# EAGLE schematic SimplePayload (EAGLE 9.2.2)
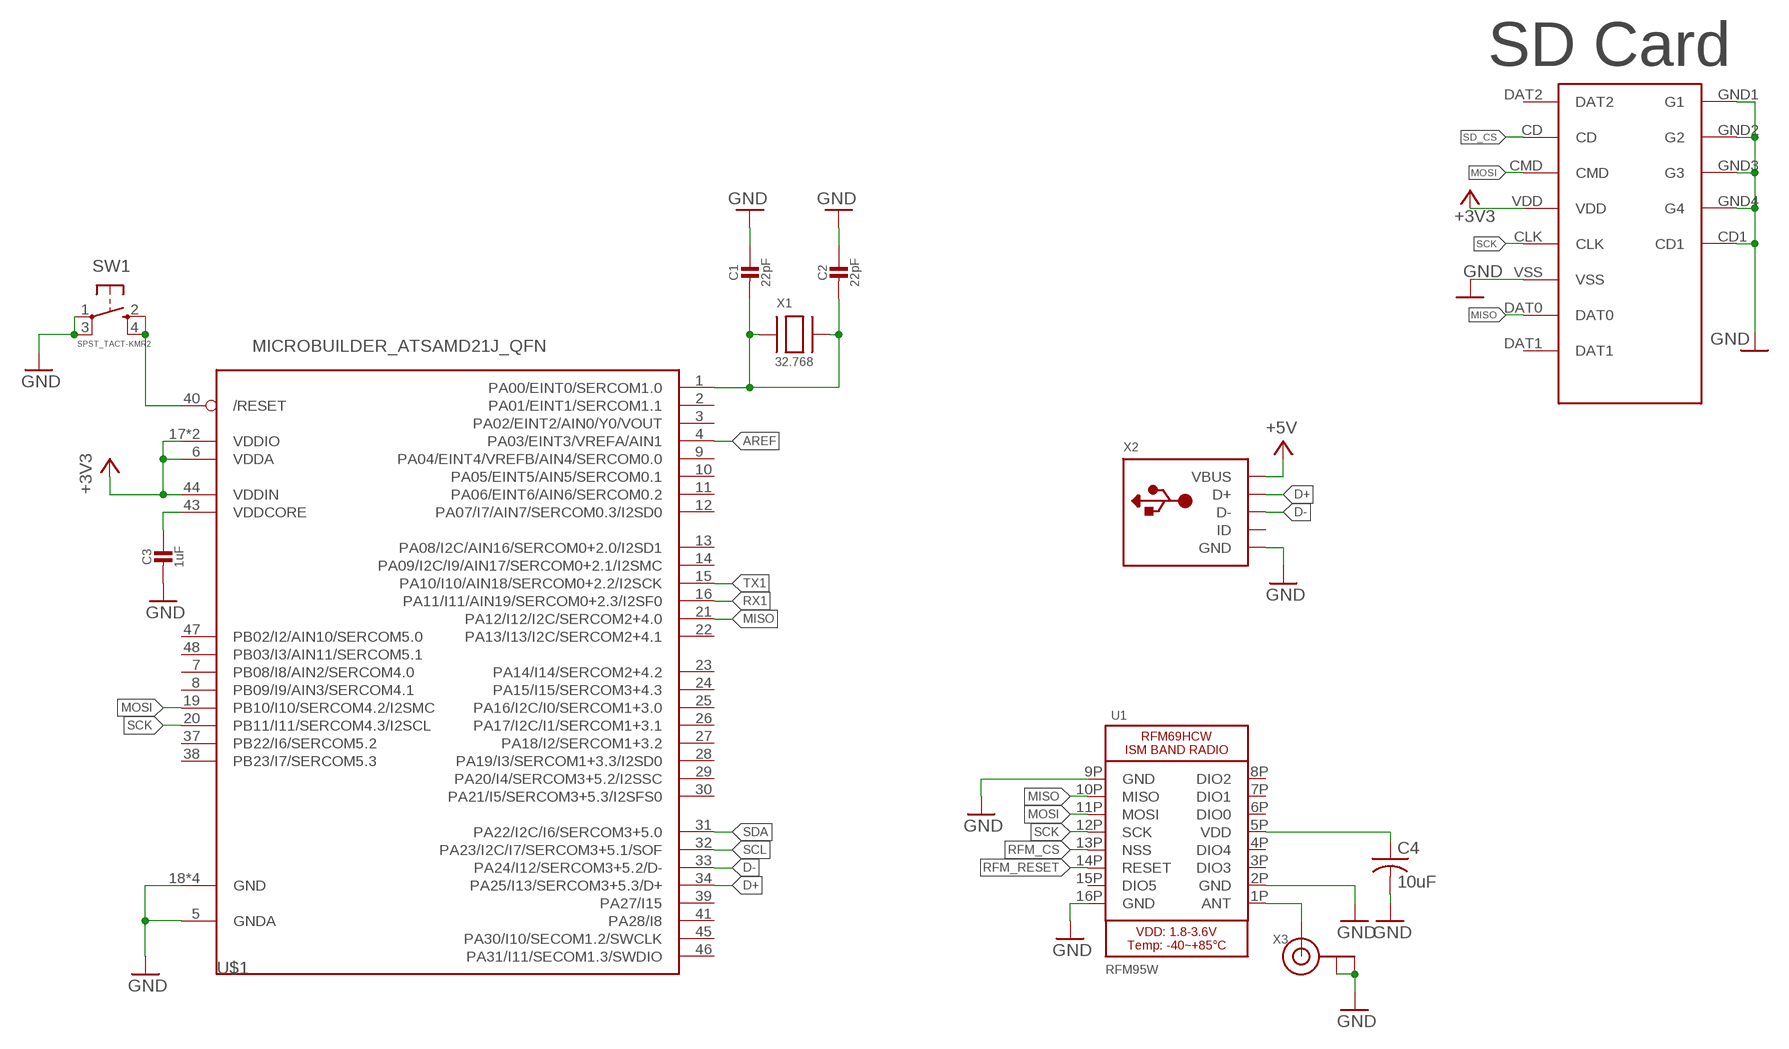
[diagram p0: schematic, sheet 1]

## Parts
C1  22pF  MICROBUILDER_CAP_CERAMIC0603_NO  [MICROBUILDER_0603-NO]
C2  22pF  MICROBUILDER_CAP_CERAMIC0603_NO  [MICROBUILDER_0603-NO]
C3  1uF  MICROBUILDER_CAP_CERAMIC0603_NO  [MICROBUILDER_0603-NO]
C4  10uF  C-USC0805  [C0805]
SW1  SPST_TACT-KMR2  [KMR2]
U1  RFM95W  MICROBUILDER_RFM69HCW_SMT  [MICROBUILDER_RFMHCW_SMT]
U$1  MICROBUILDER_ATSAMD21J_QFN  [MICROBUILDER_TQFN48_7MM]
U$4  MICRO_SD  [MICRO_SD_HINGED]
X1  32.768  ADAFRUIT2_XTAL-3.2X1.5  [ADAFRUIT2_XTAL3215]
X2  MICROBUILDER_USB_MICRO_20329_V2  [MICROBUILDER_4UCONN_20329_V2]
X3  MICROBUILDER_ANTENNA_U.FL  [MICROBUILDER_U.FL]

## Nets
+3V3: U$1.6(VDDA) U$1.17(VDDIO) U$1.36(VDDIO) U$1.44(VDDIN) U$4.VDD
+5V: X2.VBUS
AREF: U$1.4(PA03/EINT3/VREFA/AIN1)
D+: U$1.34(PA25/I13/SERCOM3+5.3/D+) X2.D+
D-: U$1.33(PA24/I12/SERCOM3+5.2/D-) X2.D-
GND: C1.1 C2.1 C3.2 C4.2 SW1.1(P) SW1.3(P1) U1.2P(GND) U1.9P(GND) U1.16P(GND) U$1.5(GNDA) U$1.18(GND) U$1.35(GND) U$1.42(GND) U$1.THERMAL(GND) U$4.CD1 U$4.GND1(G1) U$4.GND2(G2) U$4.GND3(G3) U$4.GND4(G4) U$4.VSS X2.BASE@1(GND) X2.BASE@2(GND) X2.GND X2.SPRT@1(GND) X2.SPRT@2(GND) X2.SPRT@3(GND) X2.SPRT@4(GND) X3.1(GND) X3.2(GND)
MISO: U1.10P(MISO) U$1.21(PA12/I12/I2C/SERCOM2+4.0) U$4.DAT0
MOSI: U1.11P(MOSI) U$1.19(PB10/I10/SERCOM4.2/I2SMC) U$4.CMD
N$1: C1.2 C2.2 U$1.1(PA00/EINT0/SERCOM1.0) X1.P$1 X1.P$2
N$2: SW1.2(S) SW1.4(S1) U$1.40(/RESET)
N$3: C3.1 U$1.43(VDDCORE)
N$4: U1.1P(ANT) X3.3(SIGNAL)
N$5: C4.1 U1.5P(VDD)
RFM_CS: U1.13P(NSS)
RFM_RESET: U1.14P(RESET)
RX1: U$1.16(PA11/I11/AIN19/SERCOM0+2.3/I2SF0)
SCK: U1.12P(SCK) U$1.20(PB11/I11/SERCOM4.3/I2SCL) U$4.CLK
SCL: U$1.32(PA23/I2C/I7/SERCOM3+5.1/SOF)
SD_CS: U$4.CD
SDA: U$1.31(PA22/I2C/I6/SERCOM3+5.0)
TX1: U$1.15(PA10/I10/AIN18/SERCOM0+2.2/I2SCK)
Unconnected: U1.3P(DIO3) U1.4P(DIO4) U1.6P(DIO0) U1.7P(DIO1) U1.8P(DIO2) U1.15P(DIO5) U$1.2(PA01/EINT1/SERCOM1.1) U$1.3(PA02/EINT2/AIN0/Y0/VOUT) U$1.7(PB08/I8/AIN2/SERCOM4.0) U$1.8(PB09/I9/AIN3/SERCOM4.1) U$1.9(PA04/EINT4/VREFB/AIN4/SERCOM0.0) U$1.10(PA05/EINT5/AIN5/SERCOM0.1) U$1.11(PA06/EINT6/AIN6/SERCOM0.2) U$1.12(PA07/I7/AIN7/SERCOM0.3/I2SD0) U$1.13(PA08/I2C/AIN16/SERCOM0+2.0/I2SD1) U$1.14(PA09/I2C/I9/AIN17/SERCOM0+2.1/I2SMC) U$1.22(PA13/I13/I2C/SERCOM2+4.1) U$1.23(PA14/I14/SERCOM2+4.2) U$1.24(PA15/I15/SERCOM3+4.3) U$1.25(PA16/I2C/I0/SERCOM1+3.0) U$1.26(PA17/I2C/I1/SERCOM1+3.1) U$1.27(PA18/I2/SERCOM1+3.2) U$1.28(PA19/I3/SERCOM1+3.3/I2SD0) U$1.29(PA20/I4/SERCOM3+5.2/I2SSC) U$1.30(PA21/I5/SERCOM3+5.3/I2SFS0) U$1.37(PB22/I6/SERCOM5.2) U$1.38(PB23/I7/SERCOM5.3) U$1.39(PA27/I15) U$1.41(PA28/I8) U$1.45(PA30/I10/SECOM1.2/SWCLK) U$1.46(PA31/I11/SECOM1.3/SWDIO) U$1.47(PB02/I2/AIN10/SERCOM5.0) U$1.48(PB03/I3/AIN11/SERCOM5.1) U$4.DAT1 U$4.DAT2 X2.ID

## Notes on the sheet
- SD Card

## Library data of the parts
C1-C3 = Adafruit Feather M0 RFMxx:MICROBUILDER_CAP_CERAMIC: Ceramic Capacitors For new designs, use the packages preceded by an '_' character since they are more reliable: The following footprints should be used on most boards: _0402 - Standard footprint for regular board layouts _0603 - Standard footprint for regular board layouts _0805 - Standard footprint for regular board layouts _1206 - Standard footprint for regular board layouts For extremely tight-pitch boards where space is at a premium, the following 'micro-pitch' footprints can be used (smaller pads, no silkscreen outline, etc.): _0402MP - Micro-pitch footprint for very dense/compact boards _0603MP - Micro-pitch footprint for very dense/compact boards _0805MP - Micro-pitch footprint for very dense/compact boards _1206MP - Micro-pitch footprint for very dense/compact boards
C4 = adafruit:C-US: CAPACITOR, American symbol
SW1 = adafruit:SPST_TACT: SMT 6mm switch, EVQQ2 series http://www.ladyada.net/library/eagle
U1 = Adafruit Feather M0 RFMxx:MICROBUILDER_RFM69HCW: RFM69HCW - ISM Band RF Transceiver
U$1 = Adafruit Feather M0 RFMxx:MICROBUILDER_ATSAMD21J
U$4 = NR_connectors:MICRO_SD
X1 = Adafruit Feather M0 RFMxx:ADAFRUIT2_XTAL: Low cost SMT crystals, no capacitors included http://www.ladyada.net/library/eagle
X2 = Adafruit Feather M0 RFMxx:MICROBUILDER_USB: USB Connectors USBMINIB - Surface Mount Female Mini-B USB Connector 4UConnector: 06564
X3 = Adafruit Feather M0 RFMxx:MICROBUILDER_ANTENNA_U.FL: U.FL Antenna Connector